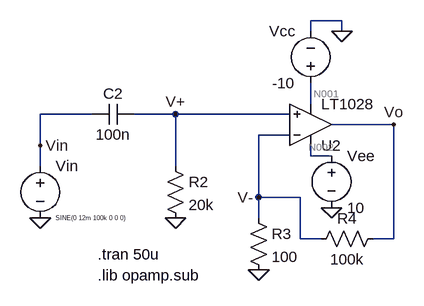
[diagram p0: schematic Spice1_2.7.asc]
Spice1_2.7.asc, the LTspice schematic file:
Version 4
SHEET 1 880 680
WIRE 320 0 272 0
WIRE 272 16 272 0
WIRE 320 16 320 0
WIRE 272 128 272 96
WIRE -64 144 -144 144
WIRE 64 144 0 144
WIRE 240 144 64 144
WIRE 400 160 304 160
WIRE 240 176 192 176
WIRE -144 192 -144 144
WIRE 272 208 272 192
WIRE 304 208 272 208
WIRE -144 224 -144 192
WIRE 64 224 64 144
WIRE 192 272 192 176
WIRE 256 272 192 272
WIRE 192 304 192 272
WIRE 256 336 256 272
WIRE 288 336 256 336
WIRE 400 336 400 160
WIRE 400 336 368 336
FLAG -144 304 0
FLAG 64 304 0
FLAG 192 384 0
FLAG 64 144 V+
FLAG 192 272 V-
FLAG 400 160 Vo
FLAG 320 16 0
FLAG 304 288 0
FLAG -144 192 Vin
SYMBOL cap 0 128 R90
WINDOW 0 0 32 VBottom 2
WINDOW 3 32 32 VTop 2
SYMATTR InstName C2
SYMATTR Value 100n
SYMBOL voltage -144 208 R0
WINDOW 3 24 96 Left 0
WINDOW 123 0 0 Left 0
WINDOW 39 0 0 Left 0
SYMATTR Value SINE(0 12m 100k 0 0 0)
SYMATTR InstName Vin
SYMBOL res 48 208 R0
SYMATTR InstName R2
SYMATTR Value 20k
SYMBOL res 176 288 R0
SYMATTR InstName R3
SYMATTR Value 100
SYMBOL res 384 320 R90
WINDOW 0 0 56 VBottom 2
WINDOW 3 32 56 VTop 2
SYMATTR InstName R4
SYMATTR Value 100k
SYMBOL OpAmps\\LT1028 272 224 M180
SYMATTR InstName U2
SYMBOL voltage 272 112 R180
WINDOW 0 24 96 Left 2
WINDOW 3 24 16 Left 2
SYMATTR InstName Vcc
SYMATTR Value -10
SYMBOL voltage 304 192 R0
SYMATTR InstName Vee
SYMATTR Value 10
TEXT -56 360 Left 2 !.tran 50u
TEXT -56 392 Left 2 !.lib opamp.sub

The netlist it stands for:
* Spice1_2.7.asc
C2 V+ Vin 100n
Vin Vin 0 SINE(0 12m 100k 0 0 0)
R2 V+ 0 20k
R3 V- 0 100
R4 Vo V- 100k
XU2 V+ V- N002 N001 Vo LT1028  ; pins In+ In- V+ V- OUT
Vcc N001 0 -10
Vee N002 0 10
.tran 50u
.lib opamp.sub
.lib LTC.lib
.backanno
.end

* Results of the author's LTspice run, read from the files saved beside the schematic
* Operating Point, zero values left out:
*   V(n002) = 10 V
*   V(n001) = -10 V
*   I(Vee) = -7.366 mA
*   I(Vcc) = 7.366 mA
*   Ix(u2:3) = 7.366 mA
*   Ix(u2:4) = -7.366 mA
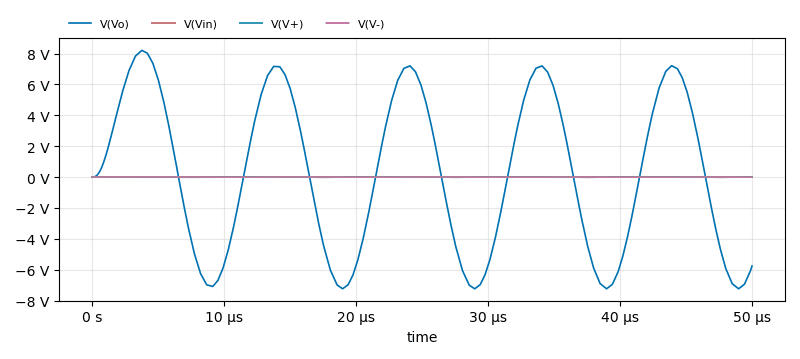
[diagram p1: Transient Analysis of Spice1_2.7.asc, plotted from the saved traces]
* Transient Analysis, 1 run:
*   V(Vo): min -7.241 V, max 8.208 V, average 240.2 mV, rms 5.154 V, last -5.765 V
*   V(Vin): min -12 mV, max 11.99 mV, average -709.3 nV, rms 8.481 mV, last 0 V
*   V(V+): min -12 mV, max 11.98 mV, average -10.24 µV, rms 8.474 mV, last 5.741 µV
*   V(V-): min -7.226 mV, max 8.193 mV, average 238.9 µV, rms 5.144 mV, last -5.726 mV